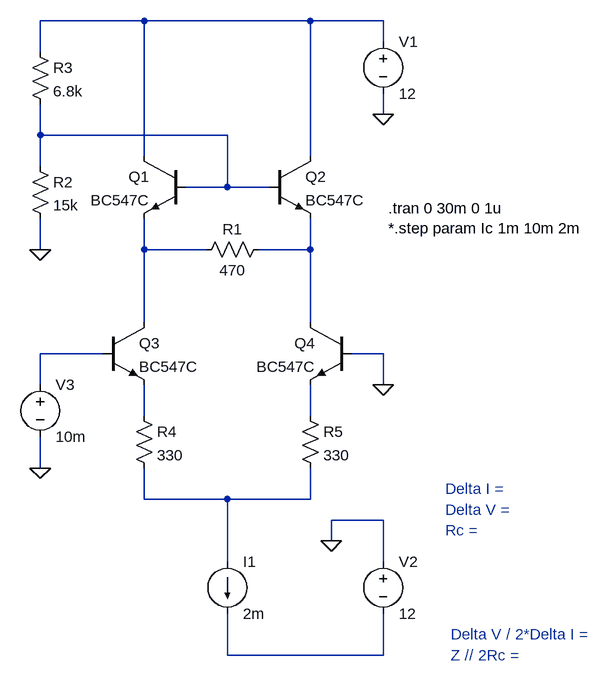
[diagram p0: schematic moog_ladder_filter-bias.asc]
moog_ladder_filter-bias.asc, the LTspice schematic file:
Version 4
SHEET 1 952 940
WIRE 32 -96 -128 -96
WIRE 288 -96 32 -96
WIRE 400 -96 288 -96
WIRE 400 -64 400 -96
WIRE -128 -48 -128 -96
WIRE 400 48 400 16
WIRE -128 80 -128 32
WIRE 160 80 -128 80
WIRE 32 112 32 -96
WIRE 288 112 288 -96
WIRE -128 128 -128 80
WIRE 160 160 160 80
WIRE 160 160 96 160
WIRE 224 160 160 160
WIRE -128 256 -128 208
WIRE 32 256 32 208
WIRE 128 256 32 256
WIRE 288 256 288 208
WIRE 288 256 208 256
WIRE 32 368 32 256
WIRE 288 368 288 256
WIRE -32 416 -128 416
WIRE 400 416 352 416
WIRE -128 464 -128 416
WIRE 400 464 400 416
WIRE 32 512 32 464
WIRE 288 512 288 464
WIRE -128 592 -128 544
WIRE 32 640 32 592
WIRE 160 640 32 640
WIRE 288 640 288 592
WIRE 288 640 160 640
WIRE 400 672 320 672
WIRE 320 704 320 672
WIRE 160 736 160 640
WIRE 400 736 400 672
WIRE 160 880 160 816
WIRE 400 880 400 816
WIRE 400 880 160 880
FLAG 400 48 0
FLAG -128 256 0
FLAG 320 704 0
FLAG 400 464 0
FLAG -128 592 0
DATAFLAG 384 352 "Ic(Q4)"
DATAFLAG -64 352 "Ic(Q3)"
DATAFLAG 704 640 "Ic(Q4)-Ic(Q3)"
DATAFLAG 704 672 "V(n003)-V(n004)"
DATAFLAG 720 704 "(0.026V)/(I(I1)/2)"
DATAFLAG 848 864 "(V(n003)-V(n004))/(2*(Ic(Q4)-Ic(Q3)))"
DATAFLAG 848 896 "1/((1/470)+(I(I1)/(0.026V)))"
SYMBOL voltage 400 -80 R0
WINDOW 123 0 0 Left 0
WINDOW 39 0 0 Left 0
SYMATTR InstName V1
SYMATTR Value 12
SYMBOL res 224 240 R90
WINDOW 0 0 56 VBottom 2
WINDOW 3 32 56 VTop 2
SYMATTR InstName R1
SYMATTR Value 470
SYMBOL npn2 96 112 M0
SYMATTR InstName Q1
SYMATTR Value BC547C
SYMBOL npn2 224 112 R0
SYMATTR InstName Q2
SYMATTR Value BC547C
SYMBOL res -144 112 R0
SYMATTR InstName R2
SYMATTR Value 15k
SYMBOL res -144 -64 R0
SYMATTR InstName R3
SYMATTR Value 6.8k
SYMBOL npn2 -32 368 R0
SYMATTR InstName Q3
SYMATTR Value BC547C
SYMBOL npn2 352 368 M0
SYMATTR InstName Q4
SYMATTR Value BC547C
SYMBOL res 16 496 R0
SYMATTR InstName R4
SYMATTR Value 330
SYMBOL res 272 496 R0
SYMATTR InstName R5
SYMATTR Value 330
SYMBOL current 160 736 R0
WINDOW 123 0 0 Left 0
WINDOW 39 0 0 Left 0
SYMATTR InstName I1
SYMATTR Value 2m
SYMBOL voltage 400 720 R0
WINDOW 123 0 0 Left 0
WINDOW 39 0 0 Left 0
SYMATTR InstName V2
SYMATTR Value 12
SYMBOL voltage -128 448 R0
WINDOW 123 0 0 Left 0
WINDOW 39 0 0 Left 0
SYMATTR InstName V3
SYMATTR Value 10m
TEXT 408 192 Left 2 !.tran 0 30m 0 1u\n*.step param Ic 1m 10m 2m
TEXT 496 624 Left 2 ;Delta I =
TEXT 496 656 Left 2 ;Delta V =
TEXT 496 688 Left 2 ;Rc =
TEXT 504 848 Left 2 ;Delta V / 2*Delta I =
TEXT 504 880 Left 2 ;Z // 2Rc =

The netlist it stands for:
* moog_ladder_filter-bias.asc
V1 N001 0 12
R1 N004 N003 470
Q1 N001 N002 N003 0 BC547C
Q2 N001 N002 N004 0 BC547C
R2 N002 0 15k
R3 N001 N002 6.8k
Q3 N003 N005 N006 0 BC547C
Q4 N004 0 N007 0 BC547C
R4 N006 N008 330
R5 N007 N008 330
I1 N008 N009 2m
V2 0 N009 12
V3 N005 0 10m
.model NPN NPN
.model PNP PNP
.lib standard.bjt
.tran 0 30m 0 1u
*.step param Ic 1m 10m 2m
* Delta I =
* Delta V =
* Rc =
* Delta V / 2*Delta I =
* Z // 2Rc =
.backanno
.end